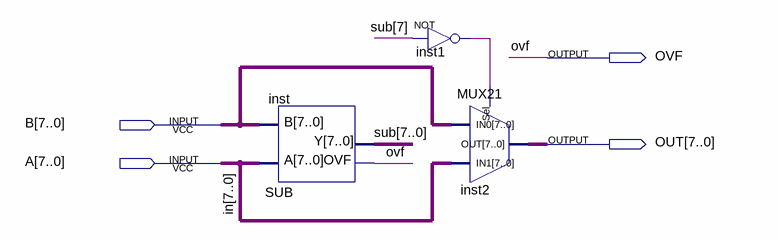
[diagram p0: schematic sheet]
// Quartus schematic MAX.bdf as structural Verilog: 3 symbols, 4 pins
module MAX (
  input  [7:0] B,
  input  [7:0] A,
  output OVF,
  output [7:0] OUT
);

  wire inst1_out;
  wire [7:0] sub;

  SUB inst (.A(A), .B(B), .OVF(OVF), .Y(sub));
  not inst1 (inst1_out, sub[7]);
  MUX21 inst2 (.Sel(inst1_out), .IN0(B), .IN1(A), .OUT(OUT));

  // Other names for the same wires on the sheet: in[7:0] = A
endmodule
